# EasyEDA schematic SCH_Cart Main PCB_2023-04-13.json
TITLE: Cart Main PCB; REV: 1.0; Date: 2023-04-11; Sheet: 1/1; Drawn By: mshnwq; Company: SCFS
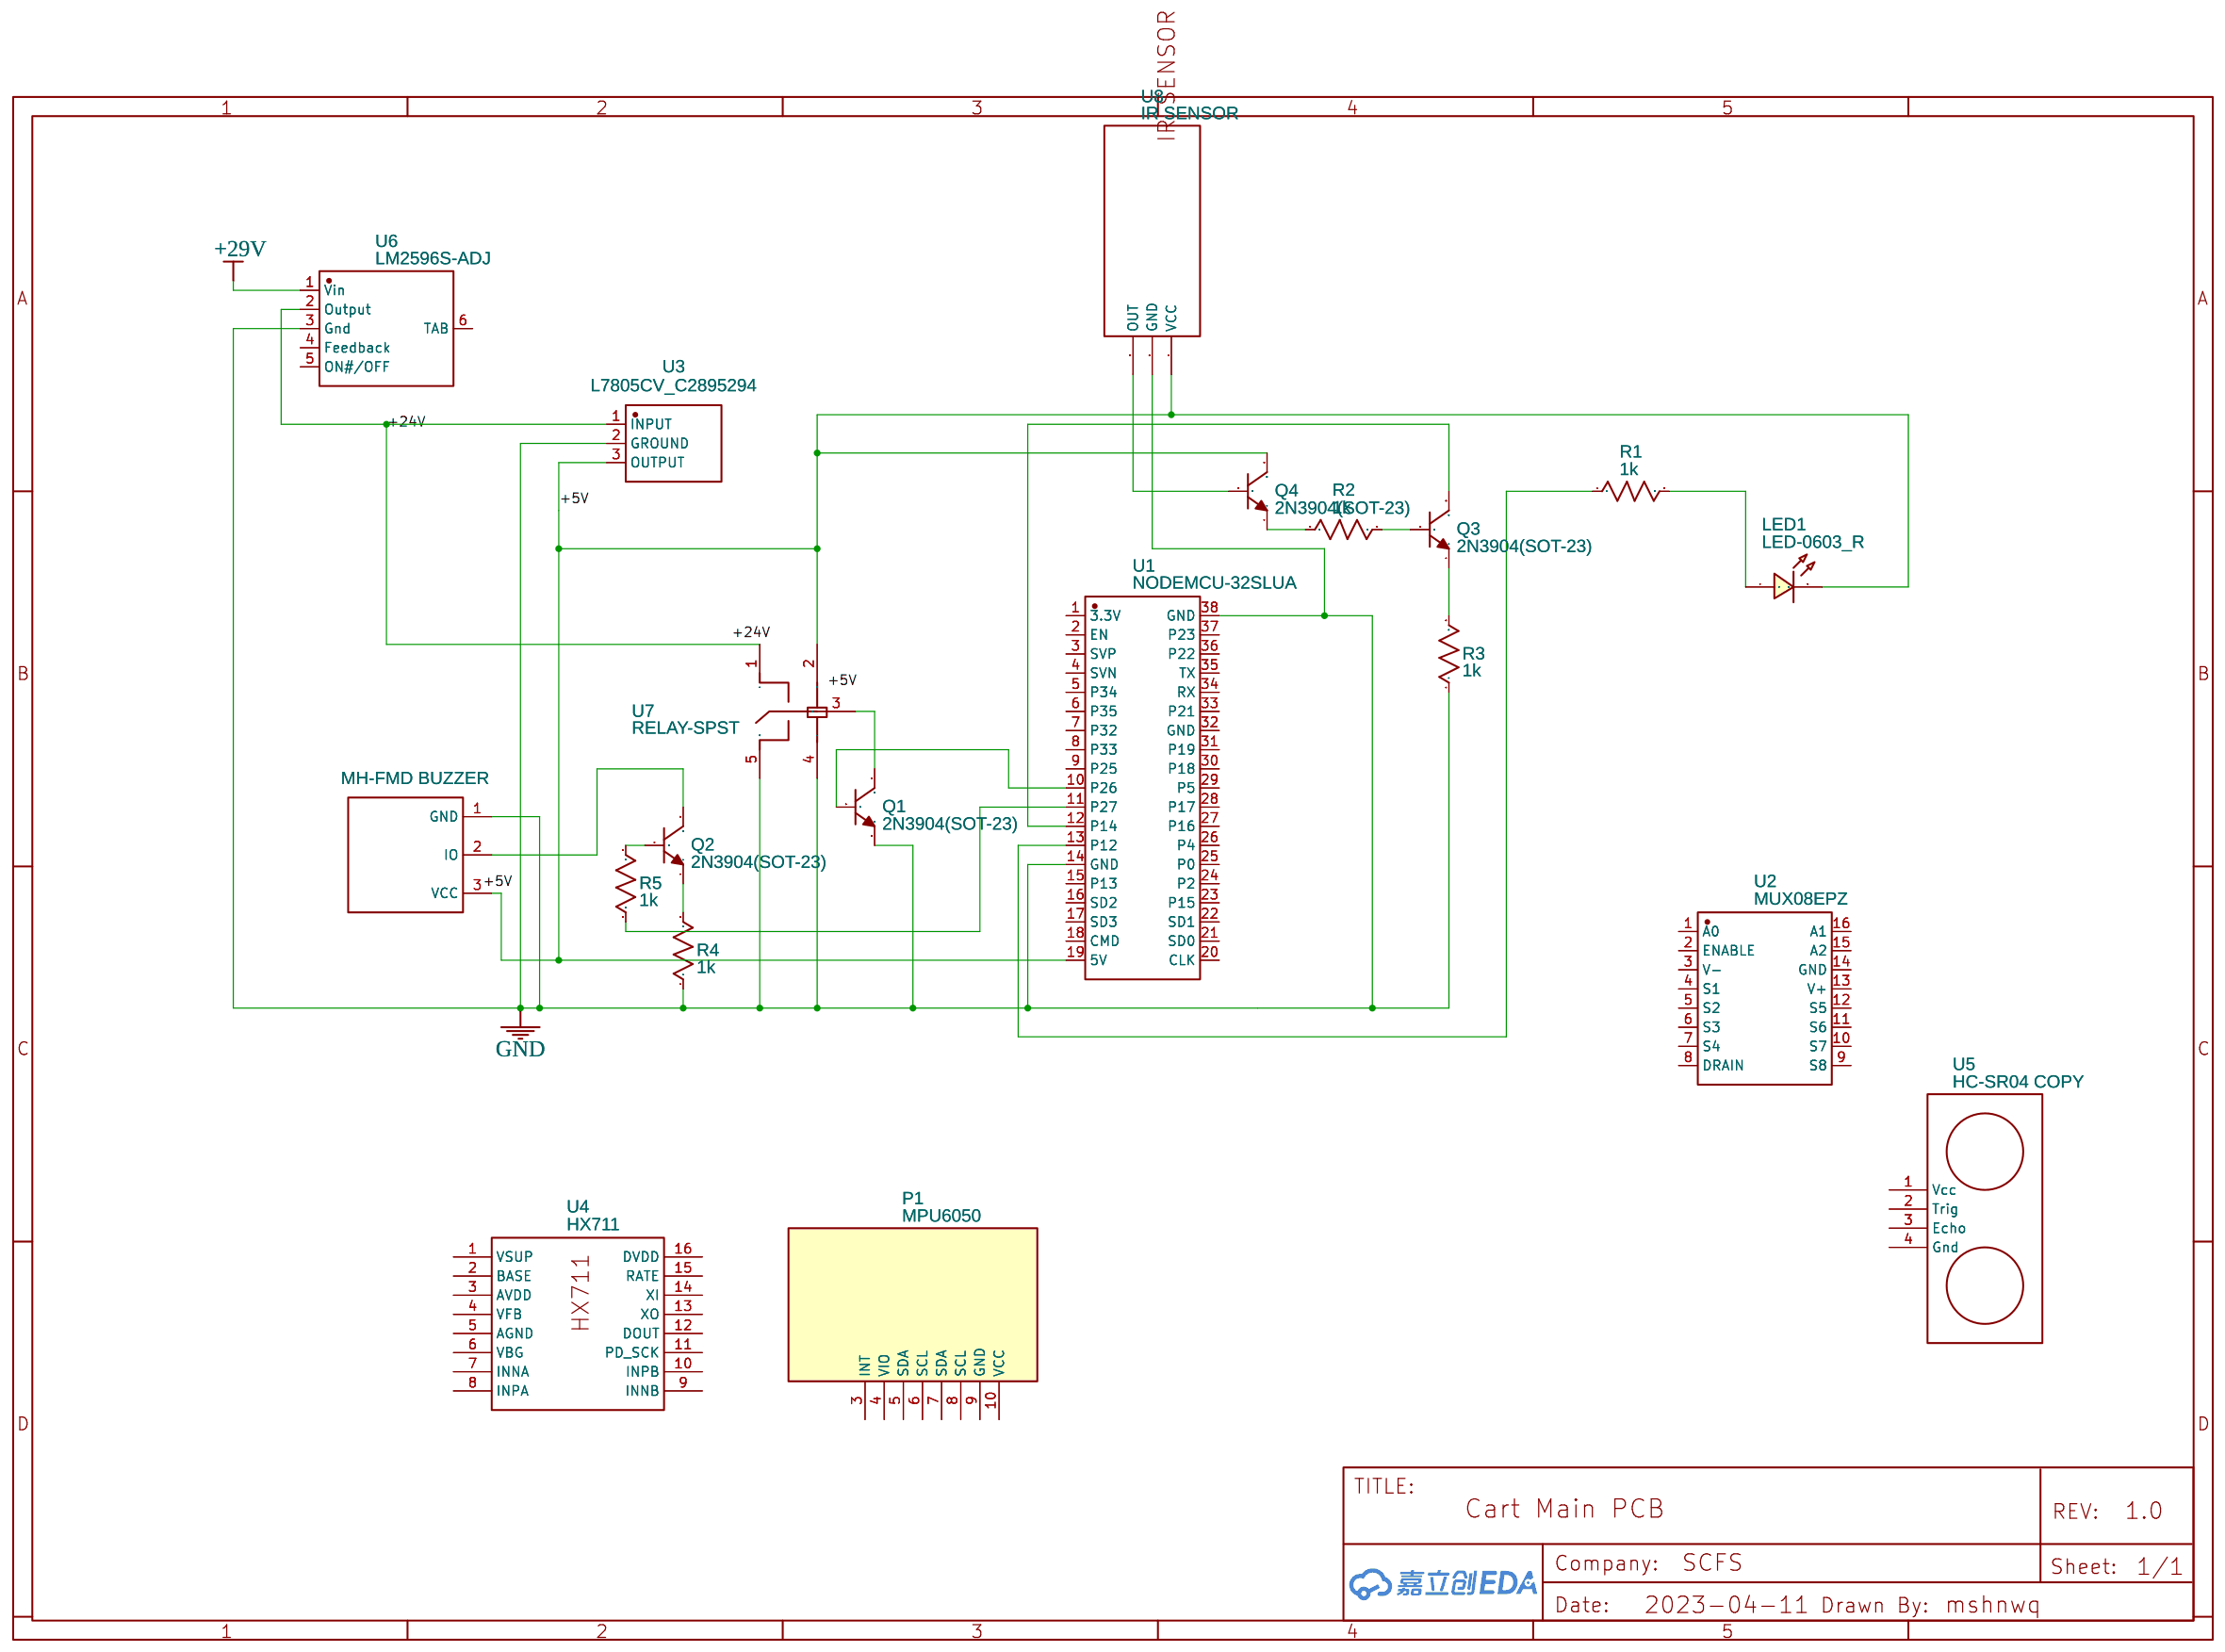
[diagram p0: schematic sheet]

## Parts
GND  MH-FMD BUZZER  [MH-FMD_ACTIVE_BUZZER_MODULE]
LED1  LED-0603_R  [LED0603_RED]
P1  MPU6050  [MPU6050]
Q1  2N3904(SOT-23)  [SOT-23-3_L2.9-W1.3-P1.90-LS2.4-TR]
Q2  2N3904(SOT-23)  [SOT-23-3_L2.9-W1.3-P1.90-LS2.4-TR]
Q3  2N3904(SOT-23)  [SOT-23-3_L2.9-W1.3-P1.90-LS2.4-TR]
Q4  2N3904(SOT-23)  [SOT-23-3_L2.9-W1.3-P1.90-LS2.4-TR]
R1  1k  [R0603]
R2  1k  [R0603]
R3  1k  [R0603]
R4  1k  [R0603]
R5  1k  [R0603]
U1  NODEMCU-32SLUA  [COMM-TH_NODEMCU-32SLUA]
U2  MUX08EPZ  [PDIP-16_L19.3-W6.4-P2.54-LS7.9-BL]
U3  L7805CV_C2895294  [TO-220_L7805CV]
U4  HX711  [SOP-16_L10.0-W3.9-P1.27-LS6.0-BL]
U5  HC-SR04 COPY  [HCSR04]
U6  LM2596S-ADJ  [TO-263-5_L10.2-W8.9-P1.70-BR]
U7  RELAY-SPST  [RELAY-TH_RELAY-SPST]
U8  IR SENSOR  [MH-SENSOR-SERIES-LINE-SENSOR]

## Library data of the parts
GND = MH-FMD BUZZER: Supplier Part: MH-FMD; Supplier: Aliexpress; Contributor: toms56; Link: https://fr.aliexpress.com/item/32893151903.html?spm=a2g0o.store_pc_allProduct.8148356.41.55e97677ipJ8xj&pdp_npi=2%40dis%21CAD%21C%24%200.87%21C%24%200.70%21%21%21%21%21%402101e9d316520193075224215ed0a
LED1 = LED-0603_R: Manufacturer: EVERLIGHT(台湾亿光); Manufacturer Part: 19-217/R6C-AL1M2VY/3T; Supplier Part: C72044; Supplier: LCSC; Contributor: LCEDA_01
P1 = MPU6050: sourceId: 1T5FDZYC8; Contributor: AmrKhaled123
Q1-Q4 = 2N3904(SOT-23): Supplier: LCSC; Manufacturer: KEC; Manufacturer Part: 2n3904S-RTK/PS; Supplier Part: C18536; Paste Type: SOT-23; Contributor: LCEDA_Lib
R1-R5 = R_0603_US: Contributor: LCEDA_Lib
U1 = NODEMCU-32SLUA: Supplier: LCSC; Supplier Part: C111436; Manufacturer: Ai-Thinker(安信可); Manufacturer Part: NodeMCU-32SLua; link: https://atta.szlcsc.com/upload/public/pdf/source/20200715/C111436_7E615125D57381075B07FD61BFD5F595.pdf; JLCPCB Part Class: Extended Part; Contributor: lcsc
U2 = MUX08EPZ: Supplier: LCSC; Supplier Part: C690856; Manufacturer: ADI(亚德诺)/LINEAR; link: https://atta.szlcsc.comnull; Contributor: LCSC
U3 = L7805CV_C2895294: Supplier: LCSC; Supplier Part: C2895294; Manufacturer: null; Manufacturer Part: L7805CV带散热器; JLCPCB Part Class: Extended Part; Contributor: LCSC
U4 = HX711: Supplier: LCSC; Manufacturer: AVIA(海芯科技); Supplier Part: C43656; JLCPCB Part Class: Extended Part
U5 = HC-SR04 COPY: Contributor: allvex
U6 = LM2596S-ADJ: Supplier: LCSC; Supplier Part: C347423; Manufacturer: UMW(友台半导体); Contributor: LCSC; JLCPCB Part Class: Extended Part
U7 = RELAY-SPST: Supplier: LCSC; Supplier Part: C2941249; Manufacturer: null; Manufacturer Part: Relay-SPST; JLCPCB Part Class: Extended Part; Contributor: LCSC
U8 = MH-Sensor-Series Line Sensor: Contributor: vyoga.alvrizki.te20

## Nets
+5V: GND.3(VCC) LED1.2 Q4.3(C) U1.19(5V) U3.3(OUTPUT) U7.2 U8.4(VCC)
+24V: U3.1(INPUT) U6.2(Output) U7.1
+29V: U6.1(Vin)
GND: GND.1(GND) Q1.1(E) R3.1 R4.1 U1.14(GND) U1.38(GND) U3.2(GROUND) U6.3(Gnd) U7.4 U7.5 U8.3(GND)
Net-(GND-2): GND.2(IO) Q2.3(C)
Net-(LED1-1): LED1.1 R1.2
Net-(Q1-2): Q1.2(B) U1.10(P26)
Net-(Q1-3): Q1.3(C) U7.3
Net-(Q2-1): Q2.1(E) R4.2
Net-(Q2-2): Q2.2(B) R5.1
Net-(Q3-1): Q3.1(E) R3.2
Net-(Q3-2): Q3.2(B) R2.2
Net-(Q3-3): Q3.3(C) U1.12(P14)
Net-(Q4-1): Q4.1(E) R2.1
Net-(Q4-2): Q4.2(B) U8.2(OUT)
Net-(R1-1): R1.1 U1.13(P12)
Net-(R5-2): R5.2 U1.11(P27)

Not connected (* = marked no-connect by the designer): P1 3(INT) 4(VIO) 5(SDA) 6(SCL) 7(SDA) 8(SCL) 9(GND) 10(VCC); U1 1(3.3V) 2(EN) 3(SVP) 4(SVN) 5(P34) 6(P35) 7(P32) 8(P33) 9(P25) 15(P13) 16(SD2) 17(SD3) 18(CMD) 20(CLK) 21(SD0) 22(SD1) 23(P15) 24(P2) 25(P0) 26(P4) 27(P16) 28(P17) 29(P5) 30(P18) 31(P19) 32(GND) 33(P21) 34(RX) 35(TX) 36(P22) 37(P23); U2 1(A0) 2(ENABLE) 3(V-) 4(S1) 5(S2) 6(S3) 7(S4) 8(DRAIN) 9(S8) 10(S7) 11(S6) 12(S5) 13(V+) 14(GND) 15(A2) 16(A1); U4 1(VSUP) 2(BASE) 3(AVDD) 4(VFB) 5(AGND) 6(VBG) 7(INNA) 8(INPA) 9(INNB) 10(INPB) 11(PD_SCK) 12(DOUT) 13(XO) 14(XI) 15(RATE) 16(DVDD); U5 1(Vcc) 2(Trig) 3(Echo) 4(Gnd); U6 4(Feedback) 5(ON#/OFF) 6(TAB)
